# EAGLE schematic Motherboard Measurements (EAGLE 9.6.2)
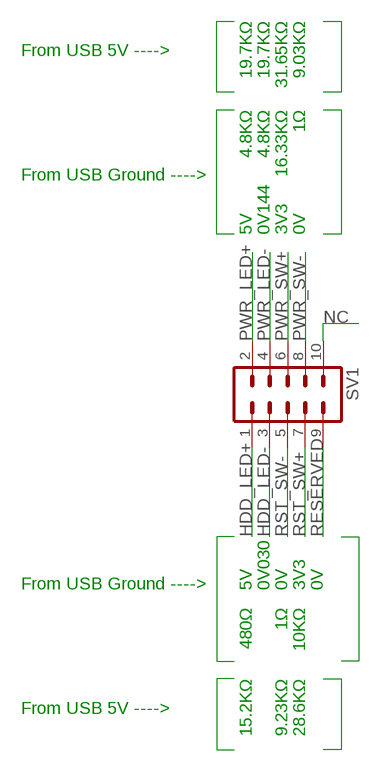
[diagram p0: schematic, sheet 1]

## Parts
SV1  MA05-2  [MA05-2]

## Nets
HDD_LED+: SV1.1
HDD_LED-: SV1.3
NC: SV1.10
PWR_LED+: SV1.2
PWR_LED-: SV1.4
PWR_SW+: SV1.6
PWR_SW-: SV1.8
RESERVED: SV1.9
RST_SW+: SV1.7
RST_SW-: SV1.5

## Notes on the sheet
- 19.7KΩ | 19.7KΩ | 31.65KΩ | 9.03KΩ
- From USB 5V ---->
- 4.8KΩ | 4.8KΩ | 16.33KΩ | 1Ω
- From USB Ground ---->
- 5V | 0V144 | 3V3 | 0V
- From USB Ground ----> | 5V | 0V030 | 0V | 3V3 | 0V
- 480Ω | 1Ω | 10KΩ
- 15.2KΩ | 9.23KΩ | 28.6KΩ
- From USB 5V ---->

## Library data of the parts
SV1 = con-lstb:MA05-2: PIN HEADER; OC_FARNELL: unknown; OC_NEWARK: unknown